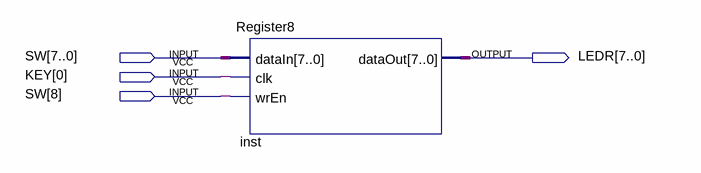
[diagram p0: schematic sheet]
// Quartus schematic RegisterDemo.bdf as structural Verilog: 1 symbols, 4 pins
module RegisterDemo (
  input  [8:0] SW,
  input  [0:0] KEY,
  output [7:0] LEDR
);

  Register8 inst (.dataIn(SW[7:0]), .clk(KEY[0]), .wrEn(SW[8]), .dataOut(LEDR));
endmodule
